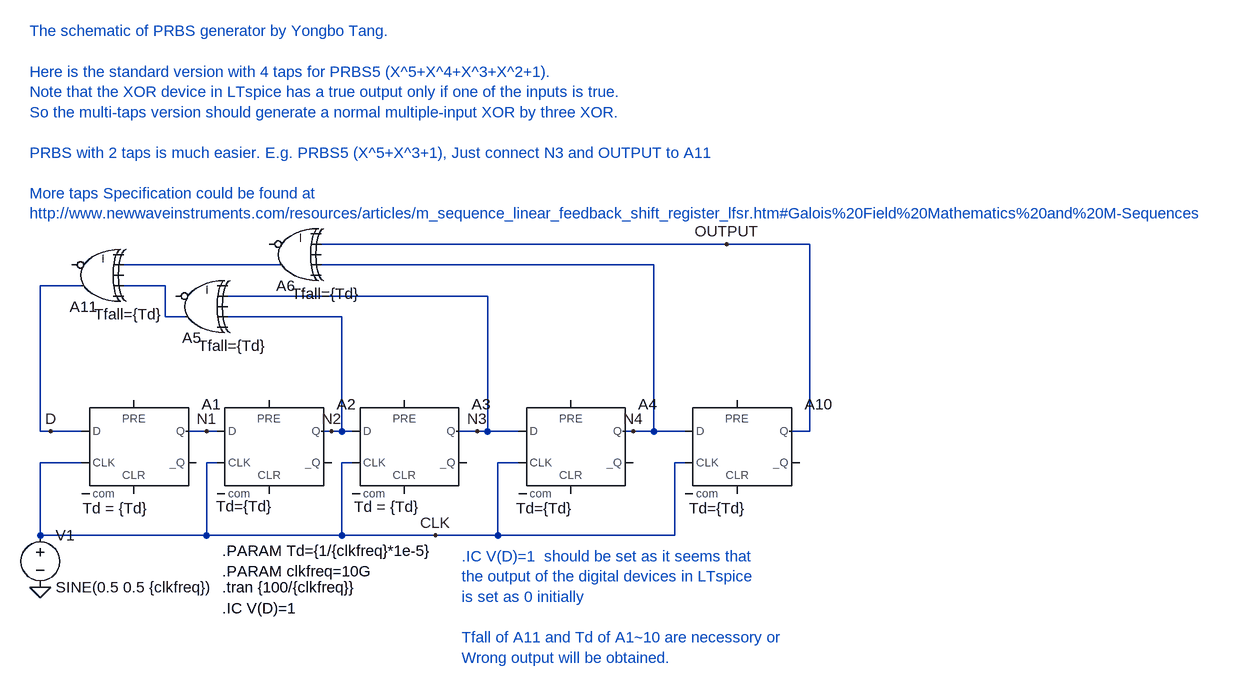
[diagram p0: schematic prbs.asc]
prbs.asc, the LTspice schematic file:
Version 4
SHEET 1 1492 680
WIRE -944 -256 -1568 -256
WIRE -816 -256 -944 -256
WIRE -1632 -224 -1872 -224
WIRE -1056 -224 -1568 -224
WIRE -1936 -192 -2000 -192
WIRE -1808 -192 -1872 -192
WIRE -1312 -176 -1712 -176
WIRE -1808 -144 -1808 -192
WIRE -1776 -144 -1808 -144
WIRE -1536 -144 -1712 -144
WIRE -2000 32 -2000 -192
WIRE -1984 32 -2000 32
WIRE -1936 32 -1984 32
WIRE -1744 32 -1776 32
WIRE -1728 32 -1744 32
WIRE -1552 32 -1568 32
WIRE -1536 32 -1536 -144
WIRE -1536 32 -1552 32
WIRE -1520 32 -1536 32
WIRE -1328 32 -1360 32
WIRE -1312 32 -1312 -176
WIRE -1312 32 -1328 32
WIRE -1264 32 -1312 32
WIRE -1088 32 -1104 32
WIRE -1056 32 -1056 -224
WIRE -1056 32 -1088 32
WIRE -1008 32 -1056 32
WIRE -816 32 -816 -256
WIRE -816 32 -848 32
WIRE -1936 80 -2000 80
WIRE -1728 80 -1744 80
WIRE -1520 80 -1536 80
WIRE -1264 80 -1296 80
WIRE -1008 80 -1024 80
WIRE -2000 192 -2000 80
WIRE -1744 192 -1744 80
WIRE -1744 192 -2000 192
WIRE -1536 192 -1536 80
WIRE -1536 192 -1744 192
WIRE -1392 192 -1536 192
WIRE -1296 192 -1296 80
WIRE -1296 192 -1392 192
WIRE -1024 192 -1024 80
WIRE -1024 192 -1296 192
FLAG -2000 272 0
FLAG -1392 192 CLK
FLAG -1984 32 D
FLAG -1744 32 N1
FLAG -1552 32 N2
FLAG -944 -256 OUTPUT
FLAG -1088 32 N4
FLAG -1328 32 N3
SYMBOL Digital\\dflop -1856 -16 R0
WINDOW 123 -79 166 Left 0
SYMATTR Value2 Td = {Td}
SYMATTR InstName A1
SYMBOL voltage -2000 176 R0
WINDOW 123 0 0 Left 0
WINDOW 39 0 0 Left 0
SYMATTR InstName V1
SYMATTR Value SINE(0.5 0.5 {clkfreq})
SYMBOL Digital\\xor -1920 -144 R180
WINDOW 3 -108 4 Left 0
SYMATTR Value Tfall={Td}
SYMATTR InstName A11
SYMBOL Digital\\dflop -928 -16 R0
WINDOW 123 -74 166 Left 0
SYMATTR Value2 Td={Td}
SYMATTR InstName A10
SYMBOL Digital\\dflop -1648 -16 R0
WINDOW 123 -81 163 Left 0
SYMATTR Value2 Td={Td}
SYMATTR InstName A2
SYMBOL Digital\\dflop -1440 -16 R0
WINDOW 123 -77 164 Left 0
SYMATTR Value2 Td = {Td}
SYMATTR InstName A3
SYMBOL Digital\\dflop -1184 -16 R0
WINDOW 123 -84 166 Left 0
SYMATTR Value2 Td={Td}
SYMATTR InstName A4
SYMBOL Digital\\xor -1760 -96 R180
WINDOW 3 -108 4 Left 0
SYMATTR Value Tfall={Td}
SYMATTR InstName A5
SYMBOL Digital\\xor -1616 -176 R180
WINDOW 3 -108 4 Left 0
SYMATTR Value Tfall={Td}
SYMATTR InstName A6
TEXT -1720 272 Left 0 !.tran {100/{clkfreq}}
TEXT -1720 216 Left 0 !.PARAM Td={1/{clkfreq}*1e-5}\n.PARAM clkfreq=10G
TEXT -1720 304 Left 0 !.IC V(D)=1
TEXT -1352 224 Left 0 ;.IC V(D)=1  should be set as it seems that \nthe output of the digital devices in LTspice\nis set as 0 initially\n \nTfall of A11 and Td of A1~10 are necessory or \nWrong output will be obtained.
TEXT -2016 -584 Left 0 ;The schematic of PRBS generator by Yongbo Tang.\n \nHere is the standard version with 4 taps for PRBS5 (X^5+X^4+X^3+X^2+1).\nNote that the XOR device in LTspice has a true output only if one of the inputs is true.\nSo the multi-taps version should generate a normal multiple-input XOR by three XOR.\n \nPRBS with 2 taps is much easier. E.g. PRBS5 (X^5+X^3+1), Just connect N3 and OUTPUT to A11 \n \nMore taps Specification could be found at\nhttp://www.newwaveinstruments.com/resources/articles/m_sequence_linear_feedback_shift_register_lfsr.htm#Galois%20Field%20Mathematics%20and%20M-Sequences

The netlist it stands for:
* prbs.asc
A1 D 0 CLK 0 0 0 N1 0 DFLOP Td = {Td}
V1 CLK 0 SINE(0.5 0.5 {clkfreq})
A11 0 N002 0 N001 0 0 D 0 XOR Tfall={Td}
A10 N4 0 CLK 0 0 0 OUTPUT 0 DFLOP Td={Td}
A2 N1 0 CLK 0 0 0 N2 0 DFLOP Td={Td}
A3 N2 0 CLK 0 0 0 N3 0 DFLOP Td = {Td}
A4 N3 0 CLK 0 0 0 N4 0 DFLOP Td={Td}
A5 0 N2 0 N3 0 0 N002 0 XOR Tfall={Td}
A6 0 N4 0 OUTPUT 0 0 N001 0 XOR Tfall={Td}
.tran {100/{clkfreq}}
.PARAM Td={1/{clkfreq}*1e-5}
.PARAM clkfreq=10G
.IC V(D)=1
* .IC V(D)=1  should be set as it seems that
* the output of the digital devices in LTspice
* is set as 0 initially
* Tfall of A11 and Td of A1~10 are necessory or
* Wrong output will be obtained.
* The schematic of PRBS generator by Yongbo Tang.
* Here is the standard version with 4 taps for PRBS5 (X^5+X^4+X^3+X^2+1).
* Note that the XOR device in LTspice has a true output only if one of the inputs is true.
* So the multi-taps version should generate a normal multiple-input XOR by three XOR.
* PRBS with 2 taps is much easier. E.g. PRBS5 (X^5+X^3+1), Just connect N3 and OUTPUT to A11
* More taps Specification could be found at
* http://www.newwaveinstruments.com/resources/articles/m_sequence_linear_feedback_shift_register_lfsr.htm#Galois%20Field%20Mathematics%20and%20M-Sequences
.backanno
.end